# EAGLE design PR9002 (EAGLE 6.6.0)
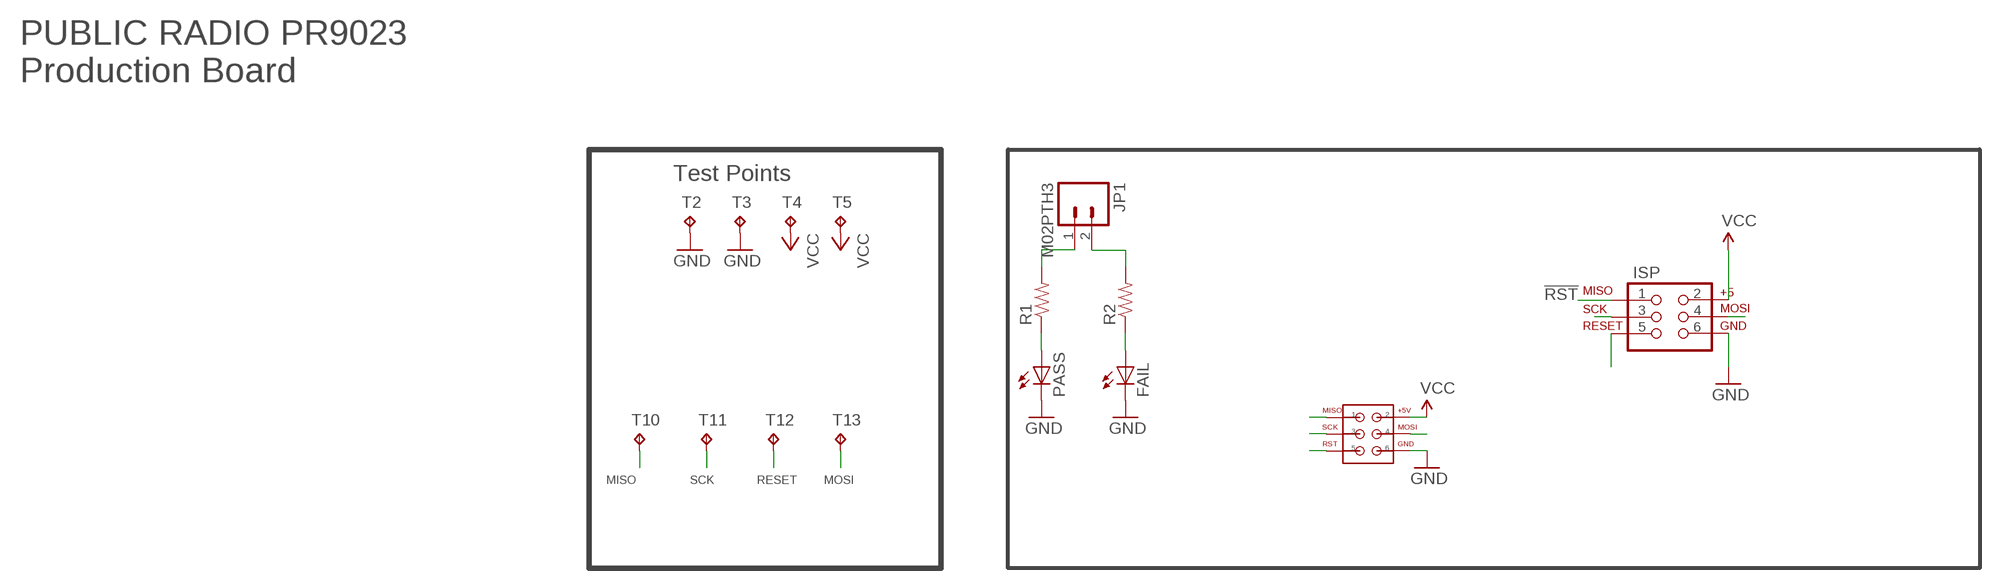
[diagram p0: schematic, sheet 1]

## Parts
FAIL  LED5MM  [LED5MM]
ISP  AVR_SPI_PRG_6NS  [2X3-NS]
JP1  M02PTH3  [1X02_LONGPADS]
PASS  LED5MM  [LED5MM]
R1  RESISTORPTH-1/4W-VERT  [AXIAL-0.1]
R2  RESISTORPTH-1/4W-VERT  [AXIAL-0.1]
T2  PR9001_TESTPOINT  [PR9001_TESTPOINT]
T3  PR9001_TESTPOINT  [PR9001_TESTPOINT]
T4  PR9001_TESTPOINT  [PR9001_TESTPOINT]
T5  PR9001_TESTPOINT  [PR9001_TESTPOINT]
T10  PR9001_TESTPOINT  [PR9001_TESTPOINT]
T11  PR9001_TESTPOINT  [PR9001_TESTPOINT]
T12  PR9001_TESTPOINT  [PR9001_TESTPOINT]
T13  PR9001_TESTPOINT  [PR9001_TESTPOINT]
U$1  ISP_POGOBED_S19_501  [ISP_POGOBED_S19_501]

## Nets
!RST: ISP.1 T10.P$1(TP) U$1.P$1
GND: FAIL.K(C) ISP.6 PASS.K(C) T2.P$1(TP) T3.P$1(TP) U$1.P$6
N$1: JP1.2 R2.P$2
N$2: PASS.A R1.P$1
N$3: JP1.1 R1.P$2
N$4: FAIL.A R2.P$1
RESET: ISP.5 T12.P$1(TP) U$1.P$5
SCLK: ISP.3 T11.P$1(TP) U$1.P$3
SDIO: ISP.4 T13.P$1(TP) U$1.P$4
VCC: ISP.2 T4.P$1(TP) T5.P$1(TP) U$1.P$2

## Notes on the sheet
- PUBLIC RADIO PR9023
  Production Board
- Test Points
- MISO | SCK | RESET | MOSI

## Library data of the parts
FAIL PASS = adafruit:LED: LED OSRAM: - CHIPLED LG R971, LG N971, LY N971, LG Q971, LY Q971, LO R971, LY R971 LH N974, LH R974 LS Q976, LO Q976, LY Q976 LO Q996 - Hyper CHIPLED LW Q18S LB Q993, LB Q99A, LB R99A - SideLED LS A670, LO A670, LY A670, LG A670, LP A670 LB A673, LV A673, LT A673, LW A673 LH A674 LY A675 LS A676, LA A676, LO A676, LY A676, LW A676 LS A679, LY A679, LG A679 - Hyper Micro SIDELED® LS Y876, LA Y876, LO Y876, LY Y876 LT Y87S - SmartLED LW L88C, LW L88S LB L89C, LB L89S, LG L890 LS L89K, LO L89K, LY L89K LS L896, LA L896, LO L896, LY L896 - TOPLED LS T670, LO T670, LY T670, LG T670, LP T670 LSG T670, LSP T670, LSY T670, LOP T670, LYG T670 LG T671, LOG T671, LSG T671 LB T673, LV T673, LT T673, LW T673 LH T674 LS T676, LA T676, LO T676, LY T676, LB T676, LH T676, LSB T676, LW T676 LB T67C, LV T67C, LT T67C, LS T67K, LO T67K, LY T67K, LW E67C LS E67B, LA E67B, LO E67B, LY E67B, LB E67C, LV E67C, LT E67C LW T67C LS T679, LY T679, LG T679 LS T770, LO T770, LY T770, LG T770, LP T770 LB T773, LV T773, LT T773, LW T773 LH T774 LS E675, LA E675, LY E675, LS T675 LS T776, LA T776, LO T776, LY T776, LB T776 LHGB T686 LT T68C, LB T68C - Hyper Mini TOPLED® LB M676 - Mini TOPLED Santana® LG M470 LS M47K, LO M47K, LY M47K Source: http://www.osram.convergy.de/
ISP = PR_Parts_Library:AVR_SPI_PRG_6: DIL VERTICAL PC TAIL PIN HEADER; MFG_PN: M20-9980346
JP1 = SparkFun-Connectors:M02: Standard 2-pin 0.1" header. Use with - straight break away headers ( PRT-00116) - right angle break away headers (PRT-00553) - swiss pins (PRT-00743) - machine pins (PRT-00117) - female headers (PRT-00115) Molex polarized connector foot print use with: PRT-08233 with associated crimp pins and housings. 2.54_SCREWTERM for use with PRT-10571. 3.5mm Screw Terminal footprints for PRT-08084 5mm Screw Terminal footprints for use with PRT-08432
R1 R2 = SparkFun-Resistors:RESISTOR: Resistor Basic schematic elements and footprints for 0603, 1206, and PTH resistors.
T2-T5 T10-T13 = PR_Parts_Library:PR9001_TESTPOINT
U$1 = PR_Parts_Library:ISP_POGOBED_S19_501

## Net classes
1 antenna: clearance 1.27 mm

## Board
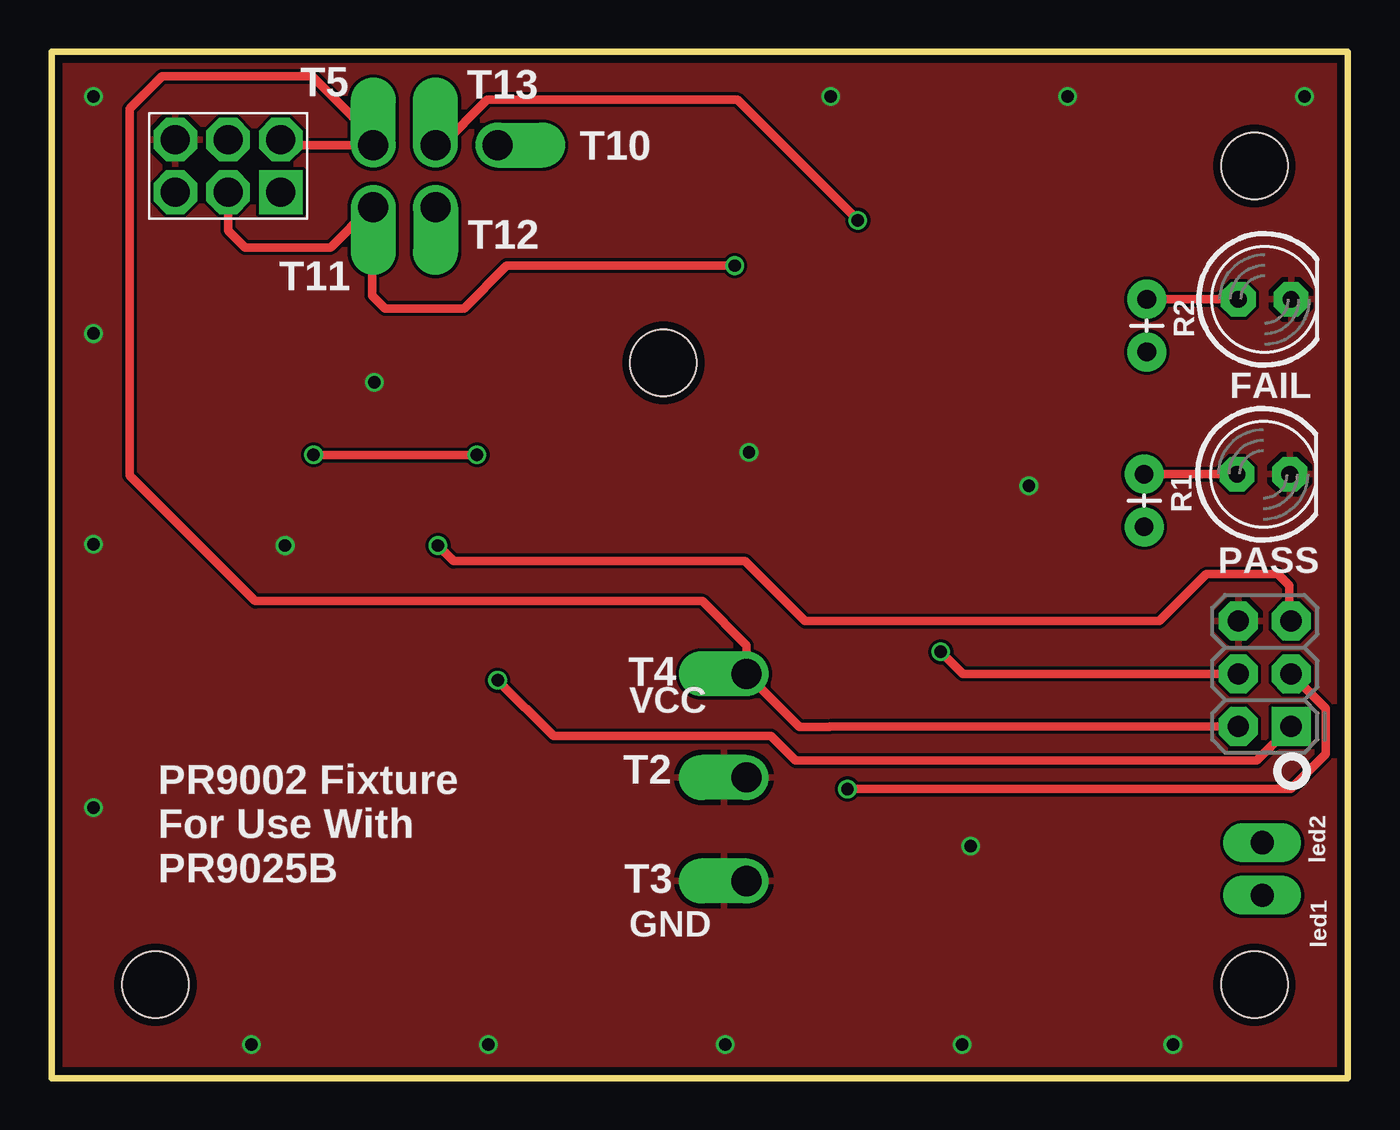
[diagram p1: board, top side]
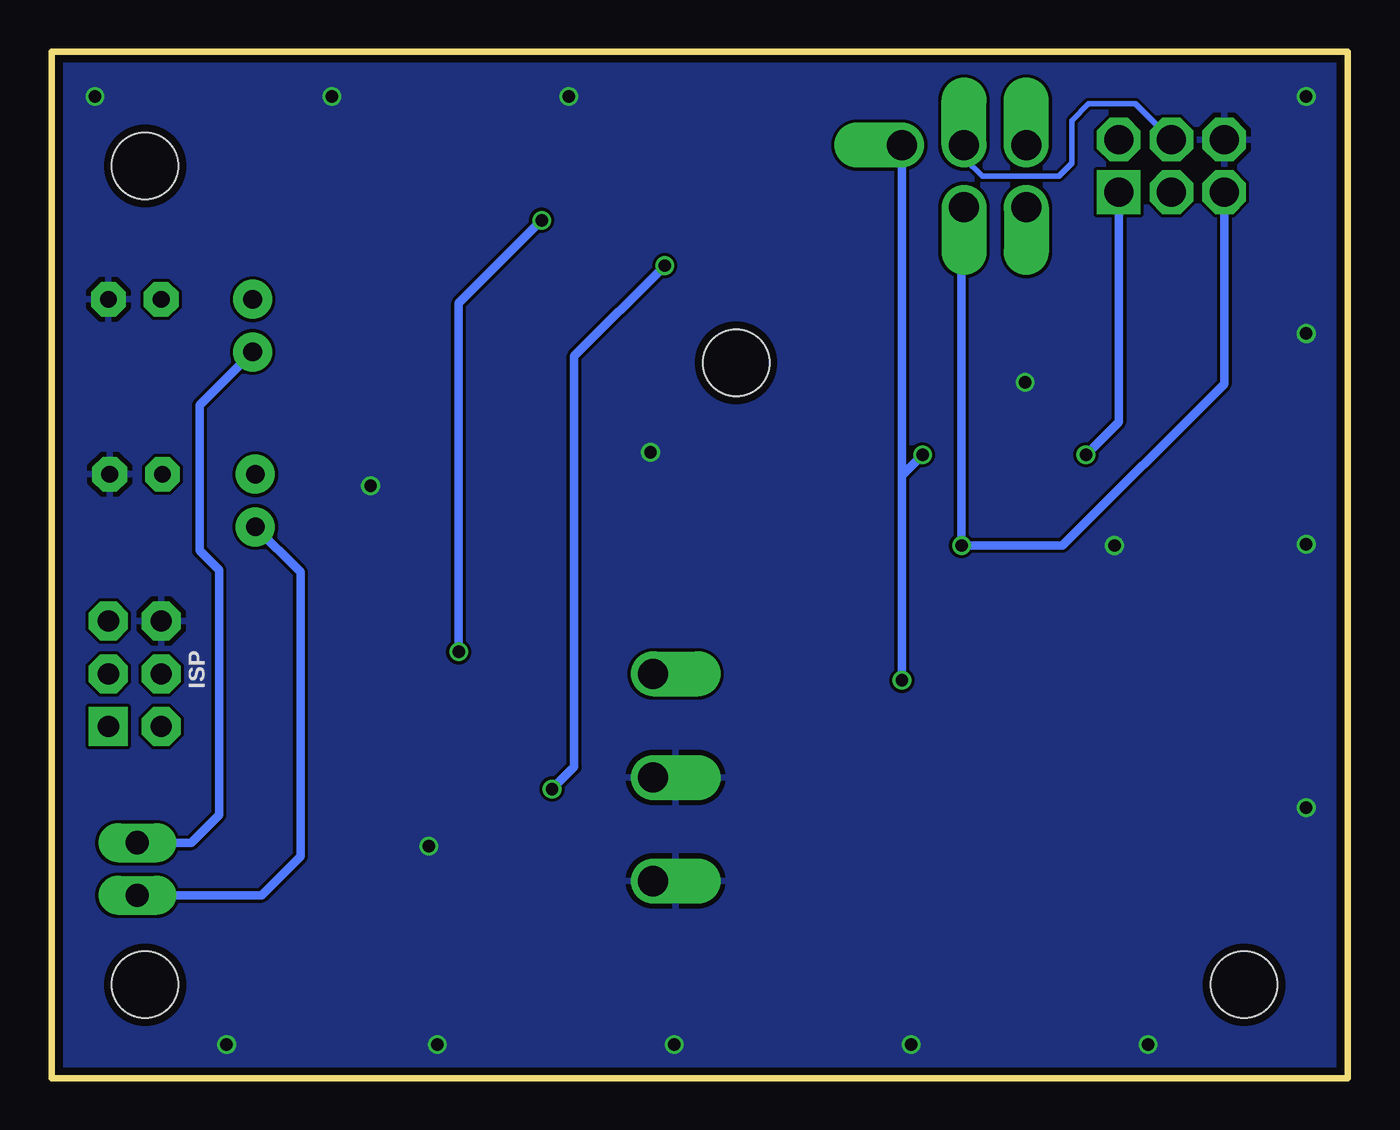
[diagram p2: board, bottom side, seen from below]

Size 62.5 x 49.5 mm. Coordinates in mm from the lower left corner, seen from the top.
Outline: 0,49.5 62.5,49.5 62.5,0 0,0 0,49.5
Copper layers (1*16): Top 0.0356mm / dielectric 1.5011mm / Bottom 0.0356mm
Design rules "LaenPCBOrder *": minimum track width 6mil, minimum drill 13mil, track to track 6mil, track to pad 6mil, pad to pad 6mil, via to via 6mil, smd to smd 6mil, copper to edge 15mil, drill to drill 6mil, minimum pad ring 7mil, minimum via ring 5mil, stop-mask expansion 3mil, vias tented up to drill 0mil, thermal gap 10mil
Holes 3.2 mm at 5,4.5 58,4.5 58,44 29.5,34.5

### Footprints (pad centres in the part's own frame; a part is rotated, then mirrored left to right if it is on the bottom)
LED5MM = drill 0.813 pad 1.676 octagon: A -1.27,0; K 1.27,0
2X3-NS = drill 1.016 pad 1.88 square: 1 -2.54,-1.27 | drill 1.016 pad 1.88 octagon: 2 -2.54,1.27; 3 0,-1.27; 4 0,1.27; 5 2.54,-1.27; 6 2.54,1.27
1X02_LONGPADS = drill 1.118 pad 1.88 long: 1 0,0; 2 2.54,0
AXIAL-0.1 = drill 0.9 pad 1.88: P$1 0,0; P$2 2.54,0
PR9001_TESTPOINT = drill 1.45 offset: P$1 0,0
ISP_POGOBED_S19_501 = drill 1.4 square: P$1 -1.27,-2.54 | drill 1.4 octagon: P$2 1.27,-2.54; P$3 -1.27,0; P$4 1.27,0; P$5 -1.27,2.54; P$6 1.27,2.54

### Placement (x,y rotation side)
FAIL  58.5,37.56 0 top
ISP  58.5,19.5 90 top
JP1  58.38,8.81 90 top
PASS  58.44,29.12 0 top
R1  52.69,29.12 270 top
R2  52.81,37.56 270 top
T2  33.5,14.5 0 bottom
T3  33.5,9.5 0 bottom
T4  33.5,19.5 0 bottom
T5  15.5,45 90 bottom
T10  21.5,45 180 bottom
T11  15.5,42 270 bottom
T12  18.5,42 270 bottom
T13  18.5,45 90 bottom
U$1  8.5,44 90 top

### Tracks (layer width: path | path; a pad name or v marks a point on that pad's centre or on a via)
!RST  (via drill 0.6)
  Top 0.406: v21.5,19.19 24.19,16.5 34.69,16.5 35.88,15.31 58.12,15.31 ISP.1 | v12.62,30.06 v20.5,30.06
  Bottom 0.406: v21.5,19.19 21.5,29.06 | 21.5,29.06 T10.P$1 | 21.5,29.06 v20.5,30.06 20.5,30.12 | U$1.P$1 11.04,31.65 v12.62,30.06
GND  (via drill 0.6)
  other vias: 15.56,33.56 11.25,25.69 2,25.75 47.12,28.56 33.62,30.19 44.31,11.19 2,47.34 2,35.91 2,13.05 9.62,1.62 21.05,1.62 32.48,1.62 43.91,1.62 54.07,1.62 37.56,47.34 48.99,47.34 60.42,47.34
  pour Bottom: 0.06,49.5 63,49.5 62.88,-0.5 -0.06,-0.5
  pour Top: -0.06,49.5 62.75,49.5 62.75,-0.5 -0.06,-0.5
N$1
  Bottom 0.406: JP1.2 55.77,11.35 54.44,12.69 54.44,24.5 55.38,25.44 55.38,32.46 R2.P$2
N$2
  Top 0.406: R1.P$1 PASS.A
N$3
  Bottom 0.406: JP1.1 52.38,8.81 50.5,10.69 50.5,24.4 R1.P$2
N$4
  Top 0.406: R2.P$1 FAIL.A
N$21
  pour Bottom: 
RESET  (via drill 0.6)
  Top 0.406: ISP.5 59.69,22.12 59.69,23.75 59.12,24.31 55.69,24.31 53.42,22.04 36.34,22.04 33.44,24.94 19.38,24.94 v18.62,25.69
  Bottom 0.406: T12.P$1 18.62,41.88 v18.62,25.69 13.75,25.69 5.96,33.48 U$1.P$5
SCLK  (via drill 0.6)
  Top 0.406: v32.94,39.19 21.94,39.19 19.88,37.12 16.06,37.12 15.44,37.75 15.44,41.94 | 15.44,41.94 T11.P$1 | 15.44,41.94 15.31,41.94 13.44,40.06 9.31,40.06 8.5,40.88 U$1.P$3 | v38.38,13.94 59.75,13.94 61.44,15.62 61.44,17.83 ISP.3
  Bottom 0.406: v32.94,39.19 37.31,34.81 37.31,15 v38.38,13.94
SDIO  (via drill 0.6)
  Top 0.406: ISP.4 43.94,19.5 v42.88,20.56 | v38.88,41.38 33.06,47.19 21,47.19 18.81,45 T13.P$1
  Bottom 0.254: T13.P$1 18.5,44.38 17.62,43.5 13.94,43.5 13.31,44.12 13.31,46.19 12.5,47 10.23,47 U$1.P$4
  Bottom 0.406: v38.88,41.38 42.88,37.38 v42.88,20.56
VCC
  Top 0.406: ISP.2 37.52,16.96 37.5,16.94 36.06,16.94 T4.P$1 33.5,20.88 31.38,23 9.81,23 3.75,29.06 3.75,46.75 5.31,48.31 12.56,48.31 15.5,45.38 T5.P$1 11.31,45 U$1.P$2

### Text on the board
tNames: VCC | led2 | PR9002 Fixture / For Use With / PR9025B | GND | led1